# Altium schematic sheet Sheet_1_2021-12-20.schdoc
size 49 x 40 mm
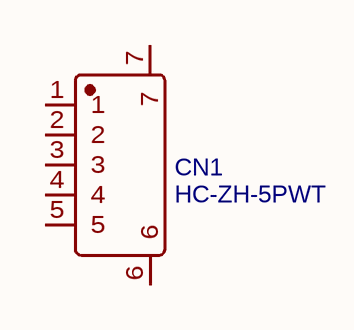
[diagram p0: Sheet_1_2021-12-20.schdoc]

## Parts
CN1  HC-ZH-5PWT  [CONN-SMD_5P-P1.50_HCTL_HC-ZH-5PWT]

## Nets

Not connected (* = marked no-connect by the designer): CN1 1 2 3 4 5 6 7

## Library data of the parts
CN1 = HC-ZH-5PWT: BOM_Manufacturer: HCTL(华灿天禄); Contributor: LCSC; BOM_Supplier: LCSC; BOM_Supplier Part: C2845427; BOM_Manufacturer Part: HC-ZH-5PWT; spicePre: C; spiceSymbolName: HC-ZH-5PWT